# Altium schematic sheet Fixture Control Wiring.SchDoc
size A3; DrawnBy: Fred Guo; DocumentNumber: 4; SheetNumber: 4; SheetTotal: 5; SheetSize: A3; DrawByDate: 2023-02-05; SiteName: ESG TD Huangpu
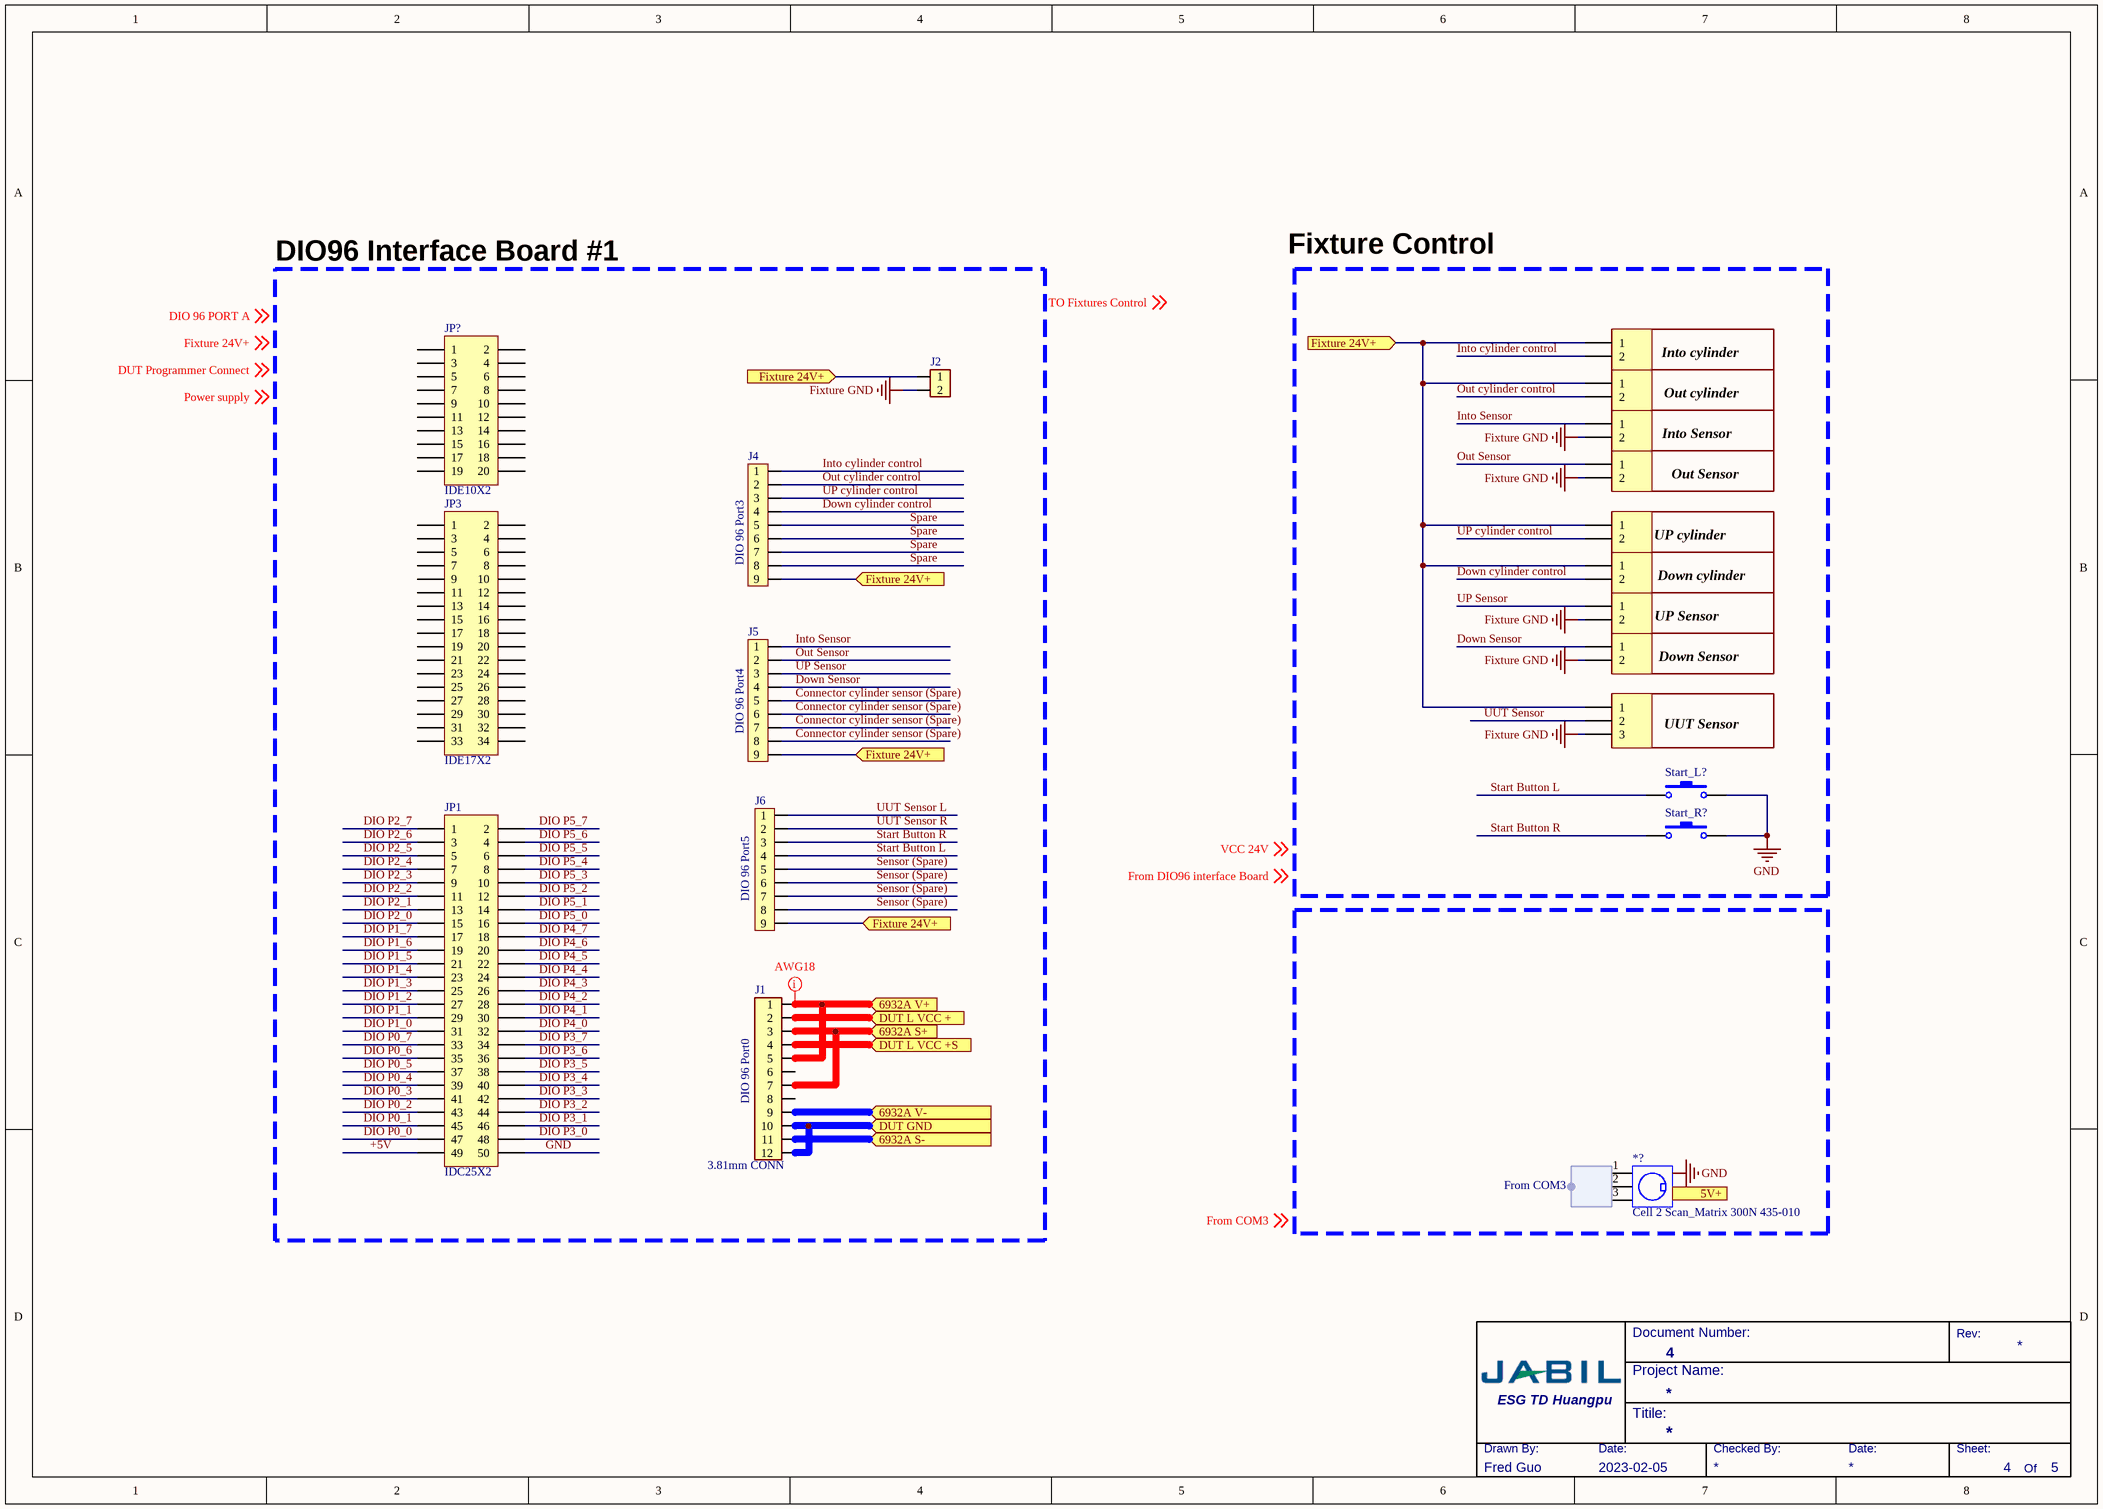
[diagram p0: Fixture Control Wiring.SchDoc]

## Parts
(Parts that share a designator on the sheet are numbered #1, #2 ... from top to bottom, then left to right.)
*?  Cell 2 Scan_Matrix 300N 435-010
?  J5  [2.54mm-9]
J1  3.81mm CONN  [3.81MM-12-Bend]
J2  (no value)  [3.81mm-2]
J?#1  (no value)  [HDR1X2H]
J?#2  (no value)  [HDR1X2H]
J?#3  (no value)  [HDR1X2H]
J?#4  (no value)  [HDR1X2H]
J?#5  J4  [2.54mm-9]
J?#6  (no value)  [HDR1X2H]
J?#7  (no value)  [HDR1X2H]
J?#8  (no value)  [HDR1X2H]
J?#9  (no value)  [HDR1X2H]
J?#10  J6  [2.54mm-9]
JP1  IDC25X2  [IDC50]
JP3  IDE17X2  [IDE34]
JP?  IDE10X2  [IDE20]
Sensor?  COM GND  [HDR1X3]  (value not drawn)
Start_L?  (no value)
Start_R?  (no value)

## Blocks framed on the sheet
Into cylinder: J?#1
Out cylinder: J?#2
Into Sensor: J?#3
Out Sensor: J?#4
Down cylinder: J?#7
UP cylinder: J?#6
UP Sensor: J?#8
Down Sensor: J?#9
UUT Sensor: Sensor?

## Ports
5V+ (in), 6932A S+ (in), 6932A S- (in), 6932A V+ (in), 6932A V- (in), DUT GND (in), DUT L VCC + (in), DUT L VCC +S (in), Fixture 24V+ (in)

## Harnesses
From COM3: 

## Nets
Fixture GND: J2.2 J?#3.2 J?#4.2 J?#8.2 J?#9.2 Sensor?.3
GND: JP1.50 Start_L?.2 Start_R?.2
6932A S+: J1.3 J1.7 ; port 6932A S+
6932A S-: J1.11 ; port 6932A S-
6932A V+: J1.1 J1.5 ; port 6932A V+
6932A V-: J1.9 ; port 6932A V-
+5V: JP1.49
Connector cylinder sensor (Spare): ?.5 ?.6 ?.7 ?.8
DIO P0_0: JP1.47
DIO P0_1: JP1.45
DIO P0_2: JP1.43
DIO P0_3: JP1.41
DIO P0_4: JP1.39
DIO P0_5: JP1.37
DIO P0_6: JP1.35
DIO P0_7: JP1.33
DIO P1_0: JP1.31
DIO P1_1: JP1.29
DIO P1_2: JP1.27
DIO P1_3: JP1.25
DIO P1_4: JP1.23
DIO P1_5: JP1.21
DIO P1_6: JP1.19
DIO P1_7: JP1.17
DIO P2_0: JP1.15
DIO P2_1: JP1.13
DIO P2_2: JP1.11
DIO P2_3: JP1.9
DIO P2_4: JP1.7
DIO P2_5: JP1.5
DIO P2_6: JP1.3
DIO P2_7: JP1.1
DIO P3_0: JP1.48
DIO P3_1: JP1.46
DIO P3_2: JP1.44
DIO P3_3: JP1.42
DIO P3_4: JP1.40
DIO P3_5: JP1.38
DIO P3_6: JP1.36
DIO P3_7: JP1.34
DIO P4_0: JP1.32
DIO P4_1: JP1.30
DIO P4_2: JP1.28
DIO P4_3: JP1.26
DIO P4_4: JP1.24
DIO P4_5: JP1.22
DIO P4_6: JP1.20
DIO P4_7: JP1.18
DIO P5_0: JP1.16
DIO P5_1: JP1.14
DIO P5_2: JP1.12
DIO P5_3: JP1.10
DIO P5_4: JP1.8
DIO P5_5: JP1.6
DIO P5_6: JP1.4
DIO P5_7: JP1.2
Down cylinder control: J?#5.4 J?#7.2
Down Sensor: ?.4 J?#9.1
DUT GND: J1.10 J1.12 ; port DUT GND
DUT L VCC +: J1.2 ; port DUT L VCC +
DUT L VCC +S: J1.4 ; port DUT L VCC +S
Fixture 24V+: ?.9 J2.1 J?#1.1 J?#2.1 J?#5.9 J?#6.1 J?#7.1 J?#10.9 Sensor?.1 ; port Fixture 24V+
Into cylinder control: J?#1.2 J?#5.1
Into Sensor: ?.1 J?#3.1
Out cylinder control: J?#2.2 J?#5.2
Out Sensor: ?.2 J?#4.1
Sensor (Spare): J?#10.5 J?#10.6 J?#10.7 J?#10.8
Spare: J?#5.5 J?#5.6 J?#5.7 J?#5.8
Start Button L: J?#10.4 Start_L?.1
Start Button R: J?#10.3 Start_R?.1
UP cylinder control: J?#5.3 J?#6.2
UP Sensor: ?.3 J?#8.1
UUT Sensor: Sensor?.2
UUT Sensor L: J?#10.1
UUT Sensor R: J?#10.2

Not connected (* = marked no-connect by the designer): *? 1 2 3; J1 6 8; JP3 1 2 3 4 5 6 7 8 9 10 11 12 13 14 15 16 17 18 19 20 21 22 23 24 25 26 27 28 29 30 31 32 33 34; JP? 1 2 3 4 5 6 7 8 9 10 11 12 13 14 15 16 17 18 19 20

## Layout directives
net class Undefined: 6932A V+

## Notes on the sheet
- DIO96 Interface Board #1
- Fixture Control
- (near J?#5) DIO 96 Port3
- DIO 96 Port4
- (near J?#10) DIO 96 Port5
- (near J1) DIO 96 Port0
- Labels drawn without touching a wire or pin: DIO 96 PORT A, DUT Programmer Connect, Fixture 24V+, From COM3, From DIO96 interface Board, GND, Power supply, TO Fixtures Control, VCC 24V
- Document Number:
- Project Name:
- Rev:
- Drawn By:
- Date:
- Titile:
- Checked By:
- Sheet:
- Of

## Library data of the parts
*? = Mil-Connector-3-???_1
? J?#5 J?#10 = CON9-2.54: Connector
J1 = CON12-3.81
J2 = CON2-3.81
J?#1-J?#4 J?#6-J?#9 = Header 2H: Header, 2-Pin, Right Angle; LatestRevisionDate: 17-Jul-2002; LatestRevisionNote: Re-released for DXP Platform.; Publisher: Altium Limited
Sensor? = Header 3: Header, 3-Pin; LatestRevisionDate: 17-Jul-2002; LatestRevisionNote: Re-released for DXP Platform.; Publisher: Altium Limited
Start_L? Start_R? = SW_NO: Switch; Published: 24-Mar-1999; LatestRevisionDate: 17-Jul-2002; LatestRevisionNote: Re-released for DXP Platform.; PackageReference: SPST-2; Publisher: Altium Limited